# Altium project Front.PrjPcb
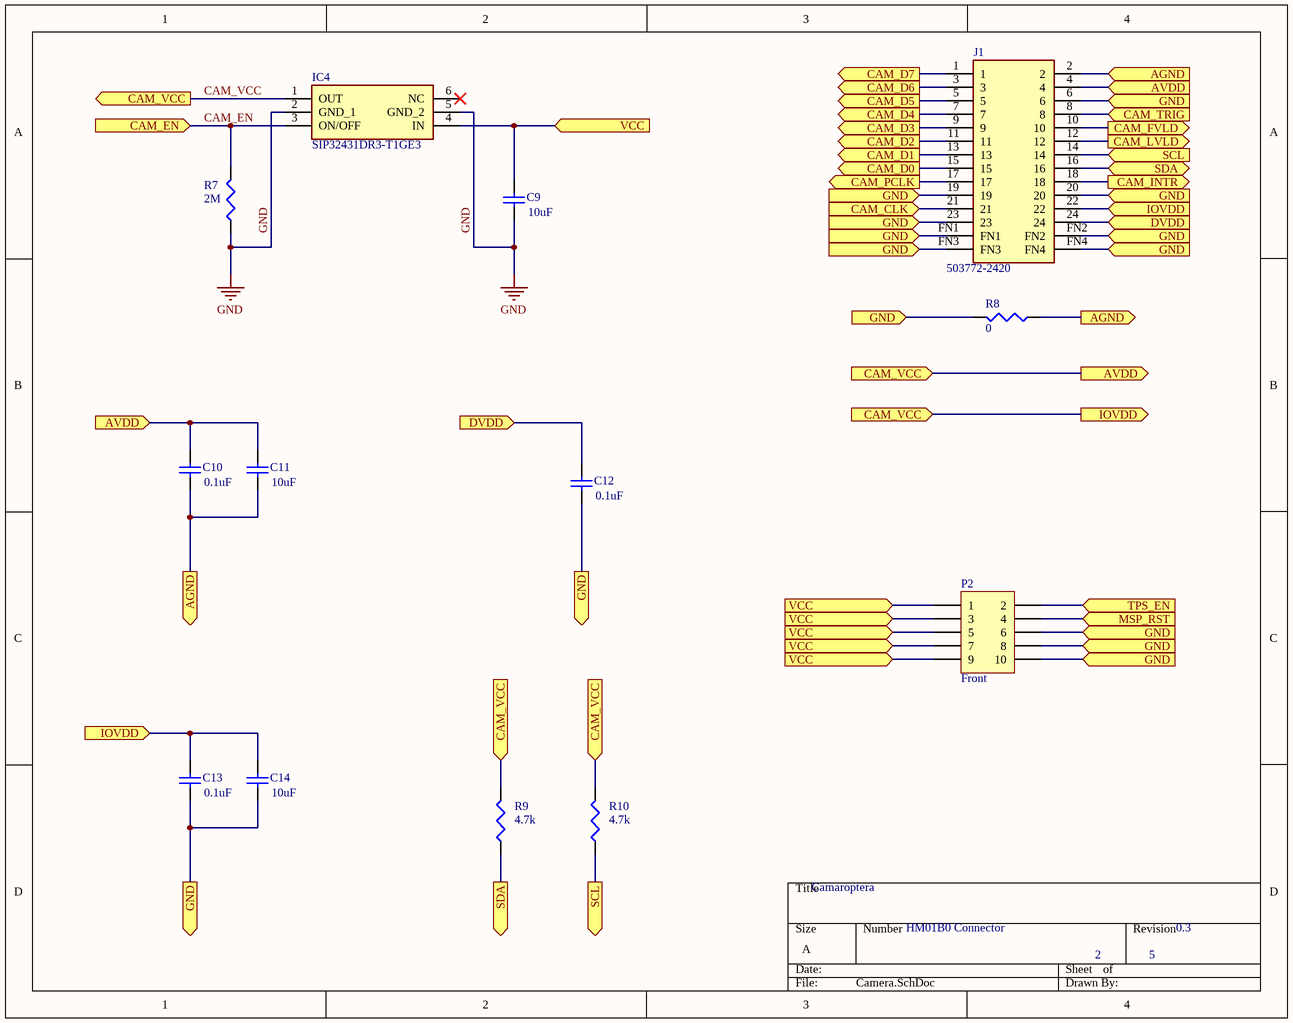
[diagram p0: Camera.SchDoc]
3 sheets, 29 parts. Net scope: flat (ports and power ports of the same name join across sheets).
Board files: Front.PcbDoc, Logos.PcbDoc
Sheets:
  Camera.SchDoc
  Radio.SchDoc
  MCU.SchDoc

## Sheet Camera.SchDoc
size A

### Parts
C9  value 10uF  [1608[0603]]  (hidden comment: Cap)
C10  value 0.1uF  [1608[0603]]  (hidden comment: Cap)
C11  value 10uF  [1608[0603]]  (hidden comment: Cap)
C12  value 0.1uF  [1608[0603]]  (hidden comment: Cap)
C13  value 0.1uF  [1608[0603]]  (hidden comment: Cap)
C14  value 10uF  [1608[0603]]  (hidden comment: Cap)
IC4  SIP32431DR3-T1GE3  [SOT65P210X110-6N]
J1  503772-2420  [5037722410]
P2  Front  [FTE-105-03-X-DH]
R7  value 2M  [J1-0603]  (hidden comment: Res3)
R8  value 0  [J1-0603]  (hidden comment: Res3)
R9  value 4.7k  [J1-0603]  (hidden comment: Res3)
R10  value 4.7k  [J1-0603]  (hidden comment: Res3)

### Ports
AGND (in), AGND (out), AVDD (in), AVDD (out), CAM_CLK (in), CAM_D0 (out), CAM_D1 (out), CAM_D2 (out), CAM_D3 (out), CAM_D4 (out), CAM_D5 (out), CAM_D6 (out), CAM_D7 (out), CAM_EN (in), CAM_FVLD (out), CAM_INTR (out), CAM_LVLD (out), CAM_PCLK (out), CAM_TRIG (in), CAM_VCC (in), CAM_VCC (out), DVDD (in), GND (in), GND (out), IOVDD (in), IOVDD (out), MSP_RST (in), SCL (in), SCL (out), SDA (bidir), SDA (out), TPS_EN (in), VCC (in)

### Nets
GND: C9.1 C12.1 C13.1 C14.1 IC4.2(GND_1) IC4.5(GND_2) J1.6 J1.19 J1.20 J1.23 J1.FN1 J1.FN2 J1.FN3 J1.FN4 P2.6 P2.8 P2.10 R7.1 R8.2 ; port GND
AGND: C10.1 C11.1 J1.2 R8.1 ; port AGND
CAM_CLK: J1.21 ; port CAM_CLK
CAM_D0: J1.15 ; port CAM_D0
CAM_D1: J1.13 ; port CAM_D1
CAM_D2: J1.11 ; port CAM_D2
CAM_D3: J1.9 ; port CAM_D3
CAM_D4: J1.7 ; port CAM_D4
CAM_D5: J1.5 ; port CAM_D5
CAM_D6: J1.3 ; port CAM_D6
CAM_D7: J1.1 ; port CAM_D7
CAM_EN: IC4.3(ON/OFF) R7.2 ; port CAM_EN
CAM_FVLD: J1.10 ; port CAM_FVLD
CAM_INTR: J1.18 ; port CAM_INTR
CAM_LVLD: J1.12 ; port CAM_LVLD
CAM_PCLK: J1.17 ; port CAM_PCLK
CAM_TRIG: J1.8 ; port CAM_TRIG
CAM_VCC: C10.2 C11.2 C13.2 C14.2 IC4.1(OUT) J1.4 J1.22 R9.2 R10.2 ; port CAM_VCC, port AVDD, port IOVDD
DVDD: C12.2 J1.24 ; port DVDD
MSP_RST: P2.4 ; port MSP_RST
SCL: J1.14 R10.1 ; port SCL
SDA: J1.16 R9.1 ; port SDA
TPS_EN: P2.2 ; port TPS_EN
VCC: C9.2 IC4.4(IN) P2.1 P2.3 P2.5 P2.7 P2.9 ; port VCC

Not connected (* = marked no-connect by the designer): IC4 6(NC)*

### Notes on the sheet
- Camaroptera
- HM01B0 Connector
- 2
- 5
- 0.3

### Library data of the parts
C9-C14 = Cap: CAP CER 6.3V X5R/X7R 0603; PackageReference: 0603; Publisher: Altium Limited; PackageDescription: Chip Capacitor, Body 1.6x0.8mm, IPC High Density
IC4 = SIP32431DR3-T1GE3: 10 pA, Ultra Low Leakage and Quiescent Current, / Load Switch with Reverse Blocking; Manufacturer_Name: Vishay; Datasheet Link: https://componentsearchengine.com/Datasheets/1/SIP32431DR3-T1GE3.pdf; Height: 1.1mm; Mouser Part Number: 781-SIP32431DR3-GE3; Mouser Price/Stock: https://www.mouser.com/Search/Refine.aspx?Keyword=781-SIP32431DR3-GE3; Manufacturer_Part_Number: SIP32431DR3-T1GE3; ComponentLink1Description: Datasheet; ComponentLink1URL: https://www.vishay.com/docs/66597/sip32431.pdf; ComponentLink2Description: Package Specification; ComponentLink2URL: https://www.vishay.com/docs/71154/71154.pdf; ComponentLink3Description: Manufacturer URL; ComponentLink3URL: https://www.vishay.com
J1 = 503772-2410: SlimStack Board-to-Board Connector. 0.40mm Pitch, B8 Series, Receptacle, 0.80mm Mated Height, 2.50mm Mated Width, 24 Circuits; Manufacturer_Name: Molex; Datasheet Link: https://componentsearchengine.com/Datasheets/1/503772-2410.pdf; Height: 0.76mm; Mouser Part Number: 538-503772-2410; Mouser Price/Stock: https://www.mouser.com/Search/Refine.aspx?Keyword=538-503772-2410; Manufacturer_Part_Number: 503772-2410; ComponentLink1Description: Package Specification; ComponentLink1URL: https://www.molex.com/pdm_docs/sd/5037722420_sd.pdf; ComponentLink2Description: Manufacturer URL; ComponentLink2URL: https://www.molex.com; ComponentLink3Description: Datasheet; ComponentLink3URL: https://www.molex.com/webdocs/datasheets/pdf/en-us/5037722420_PCB_RECEPTACLES.pdf
P2 = Header 5X2: Front  board connector; LatestRevisionDate: 17-Jul-2002; LatestRevisionNote: Re-released for DXP Platform.; Publisher: Altium Limited; System: Connector
R7-R10 = Res3: RES 1/10W 1% 0603 SMD; PackageReference: 0603; Publisher: Altium Limited; PackageDescription: Chip Resistor, Body 1.6x0.8mm, IPC High Density

## Sheet Radio.SchDoc
size A
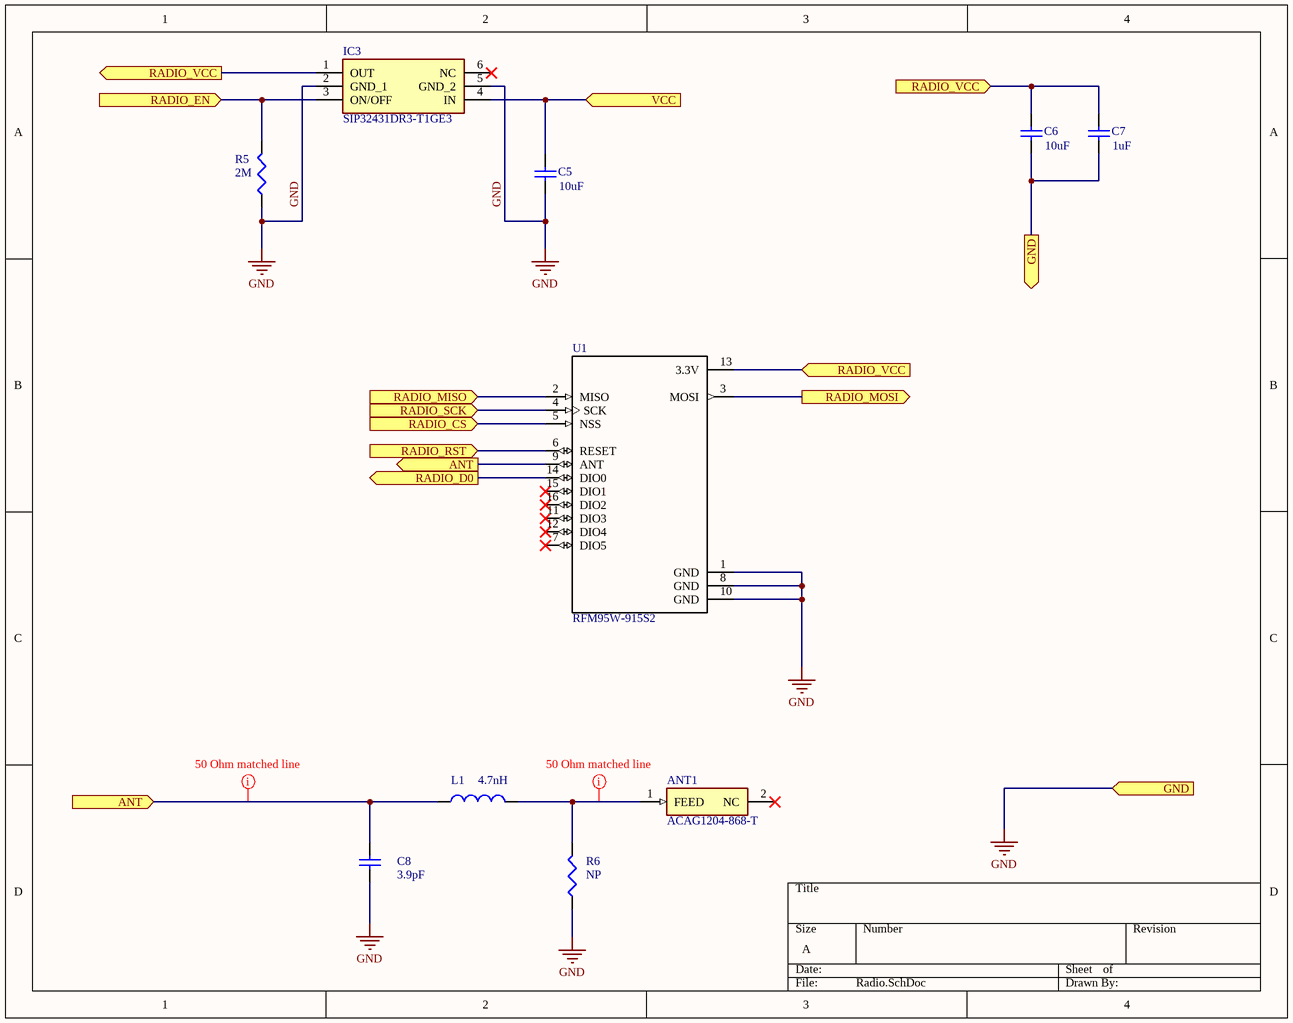
[diagram p1: Radio.SchDoc]

### Parts
ANT1  ACAG1204-868-T  [ANTC12040X170N]
C5  value 10uF  [1608[0603]]  (hidden comment: Cap)
C6  value 10uF  [1608[0603]]  (hidden comment: Cap)
C7  value 1uF  [1608[0603]]  (hidden comment: Cap)
C8  value 3.9pF  [1608[0603]]
IC3  SIP32431DR3-T1GE3  [SOT65P210X110-6N]
L1  value 4.7nH  [1608[0603]]
R5  value 2M  [J1-0603]  (hidden comment: Res3)
R6  value NP  [1608[0603]]
U1  RFM95W-915S2  [*XCVR_RFM69HW-868S2]

### Ports
ANT (in), ANT (out), GND (in), GND (out), RADIO_CS (in), RADIO_D0 (out), RADIO_EN (in), RADIO_MISO (in), RADIO_MOSI (out), RADIO_RST (in), RADIO_SCK (in), RADIO_VCC (in), RADIO_VCC (out), VCC (in)

### Nets
GND: C5.1 C6.1 C7.1 C8.1 IC3.2(GND_1) IC3.5(GND_2) R5.1 R6.1 U1.1(GND) U1.8(GND) U1.10(GND) ; port GND
ANT: C8.2 L1.1 U1.9(ANT) ; port ANT
RADIO_CS: U1.5(NSS) ; port RADIO_CS
RADIO_D0: U1.14(DIO0) ; port RADIO_D0
RADIO_EN: IC3.3(ON/OFF) R5.2 ; port RADIO_EN
RADIO_MISO: U1.2(MISO) ; port RADIO_MISO
RADIO_MOSI: U1.3(MOSI) ; port RADIO_MOSI
RADIO_RST: U1.6(RESET) ; port RADIO_RST
RADIO_SCK: U1.4(SCK) ; port RADIO_SCK
RADIO_VCC: C6.2 C7.2 IC3.1(OUT) U1.13(3.3V) ; port RADIO_VCC
VCC: C5.2 IC3.4(IN) ; port VCC
NetANT1_1: ANT1.1(FEED) L1.2 R6.2

Not connected (* = marked no-connect by the designer): ANT1 2(NC)*; IC3 6(NC)*; U1 7(DIO5)* 11(DIO3)* 12(DIO4)* 15(DIO1)* 16(DIO2)*

### Layout directives
rule Impedance Constraint [Min = 50.00    Max = 50.00    ]: ANT, NetANT1_1

### Library data of the parts
ANT1 = ACAG1204-868-T: Antenna; Manufacturer_Name: ABRACON; Datasheet Link: https://componentsearchengine.com/Datasheets/1/ACAG1204-868-T.pdf; Height: 1.7mm; Mouser Part Number: 815-G1204-868-T; Mouser Price/Stock: https://www.mouser.com/Search/Refine.aspx?Keyword=815-G1204-868-T; Manufacturer_Part_Number: ACAG1204-868-T
C5-C7 = Cap: CAP CER 6.3V X5R/X7R 0603; PackageReference: 0603; Publisher: Altium Limited; PackageDescription: Chip Capacitor, Body 1.6x0.8mm, IPC High Density
C8 = Cap: Capacitor; Published: 8-Jun-2000; LatestRevisionDate: 17-Jul-2002; LatestRevisionNote: Re-released for DXP Platform.; PackageReference: RAD-0.3; Publisher: Altium Limited; PackageDescription: Radial Cap, Thru-Hole; 2 Leads; 0.3 in Pin Spacing
IC3 = SIP32431DR3-T1GE3: as IC4 on sheet Camera; Datasheet Link: https://componentsearchengine.com/Datasheets/1/SIP32431DR3-T1GE3.pdf; Height: 1.1mm; Mouser Part Number: 781-SIP32431DR3-GE3; Mouser Price/Stock: https://www.mouser.com/Search/Refine.aspx?Keyword=781-SIP32431DR3-GE3; Manufacturer_Part_Number: SIP32431DR3-T1GE3; ComponentLink1Description: Datasheet; ComponentLink1URL: https://www.vishay.com/docs/66597/sip32431.pdf; ComponentLink2Description: Package Specification; ComponentLink2URL: https://www.vishay.com/docs/71154/71154.pdf; ComponentLink3Description: Manufacturer URL; ComponentLink3URL: https://www.vishay.com
L1 = Inductor: Code_IEC: 1005; Published: 8-Jun-2000; LatestRevisionDate: 29-May-2009; LatestRevisionNote: IPC-7351 Footprint Added.; PackageReference: 0402-A; Publisher: Altium Limited; PackageDescription: Chip Inductor; Code_JEITA: 0402
R5 = Res3: RES 1/10W 1% 0603 SMD; PackageReference: 0603; Publisher: Altium Limited; PackageDescription: Chip Resistor, Body 1.6x0.8mm, IPC High Density
R6 = Res3: Resistor; Published: 8-Jun-2000; LatestRevisionDate: 29-May-2009; LatestRevisionNote: IPC-7351 Footprint Added.; PackageReference: J1-0603; Publisher: Altium Limited; PackageDescription: Chip Resistor
U1 = RFM95W-915S2: RFM95W LoRA Transceiver Module 915MHz; MF: RF Solutions; Availability: Unavailable; SnapEDA_Link: https://www.snapeda.com/parts/RFM95W-915S2/RF%20Solutions/view-part/?ref=snap; Price: None; Package: SMD-16 RF Solutions; MP: RFM95W-915S2; Value: *

## Sheet MCU.SchDoc
size A
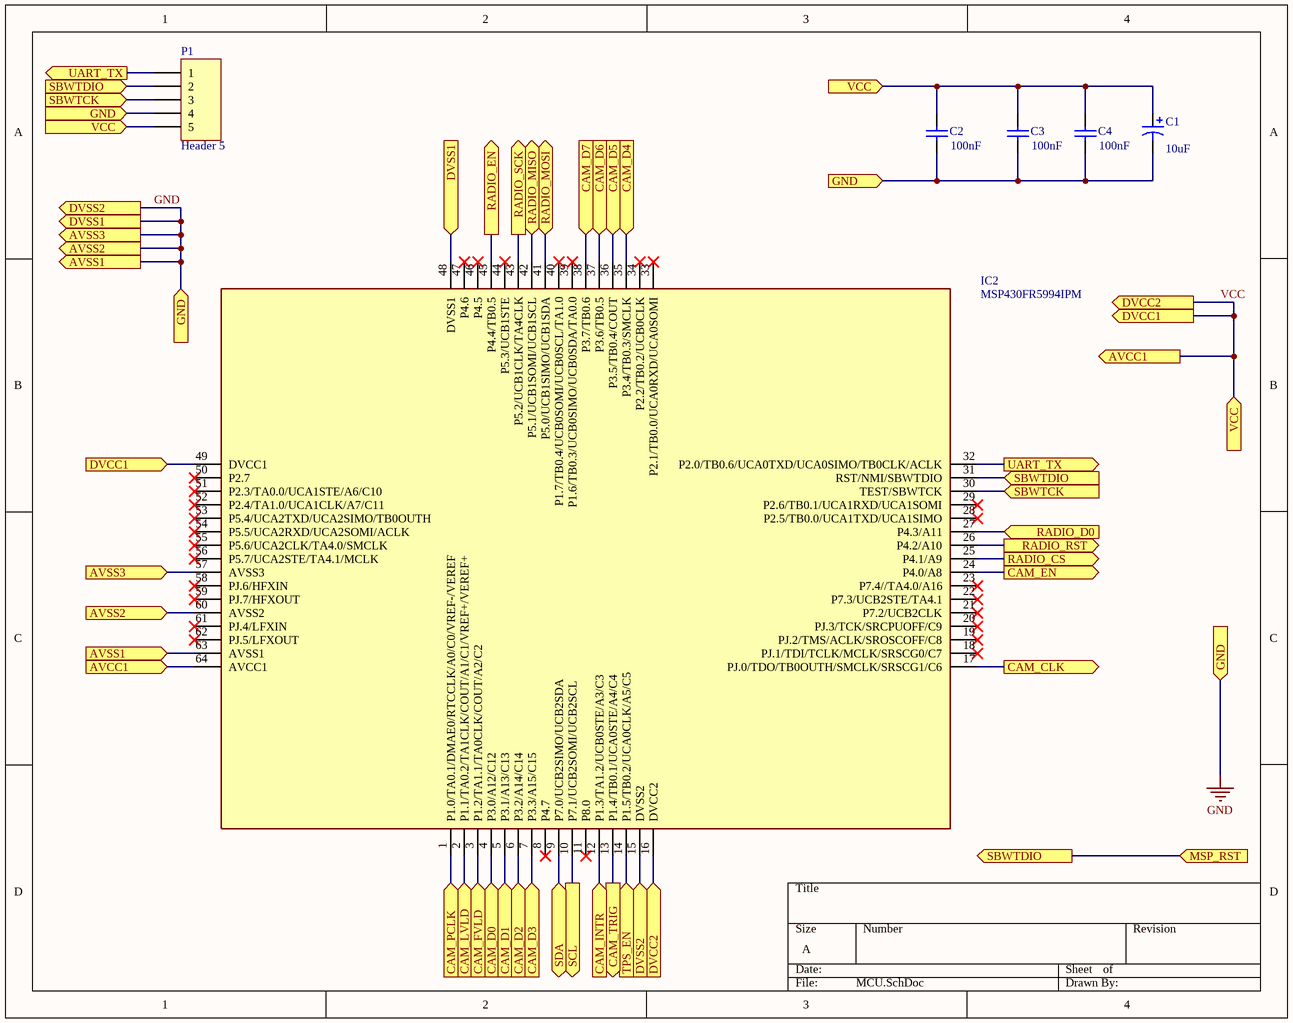
[diagram p2: MCU.SchDoc]

### Parts
C1  value 10uF  [C1210]
C2  value 100nF  [1608[0603]]  (hidden comment: Cap)
C3  value 100nF  [1608[0603]]  (hidden comment: Cap)
C4  value 100nF  [1608[0603]]  (hidden comment: Cap)
IC2  MSP430FR5994IPM  [QFP50P1200X1200X160-64N]
P1  Header 5  [MHDR1X5]

### Ports
AVCC1 (in), AVCC1 (out), AVSS1 (in), AVSS1 (out), AVSS2 (in), AVSS2 (out), AVSS3 (in), AVSS3 (out), CAM_CLK (out), CAM_D0 (in), CAM_D1 (in), CAM_D2 (in), CAM_D3 (in), CAM_D4 (in), CAM_D5 (in), CAM_D6 (in), CAM_D7 (in), CAM_EN (out), CAM_FVLD (in), CAM_INTR (in), CAM_LVLD (in), CAM_PCLK (in), CAM_TRIG (out), DVCC1 (in), DVCC1 (out), DVCC2 (in), DVCC2 (out), DVSS1 (in), DVSS1 (out), DVSS2 (in), DVSS2 (out), GND (in), MSP_RST (in), RADIO_CS (out), RADIO_D0 (in), RADIO_EN (out), RADIO_MISO (bidir), RADIO_MOSI (bidir), RADIO_RST (out), RADIO_SCK (out), SBWTCK (in), SBWTDIO (in), SBWTDIO (out), SCL (out), SDA (bidir), TPS_EN (in), UART_TX (out), VCC (in)

### Nets
GND: C1.2 C2.1 C3.1 C4.1 IC2.15(DVSS2) IC2.48(DVSS1) IC2.57(AVSS3) IC2.60(AVSS2) IC2.63(AVSS1) P1.4 ; port DVSS2, port AVSS1, port DVSS1, port AVSS2, port AVSS3, port GND
CAM_CLK: IC2.17(PJ.0/TDO/TB0OUTH/SMCLK/SRSCG1/C6) ; port CAM_CLK
CAM_D0: IC2.4(P3.0/A12/C12) ; port CAM_D0
CAM_D1: IC2.5(P3.1/A13/C13) ; port CAM_D1
CAM_D2: IC2.6(P3.2/A14/C14) ; port CAM_D2
CAM_D3: IC2.7(P3.3/A15/C15) ; port CAM_D3
CAM_D4: IC2.35(P3.4/TB0.3/SMCLK) ; port CAM_D4
CAM_D5: IC2.36(P3.5/TB0.4/COUT) ; port CAM_D5
CAM_D6: IC2.37(P3.6/TB0.5) ; port CAM_D6
CAM_D7: IC2.38(P3.7/TB0.6) ; port CAM_D7
CAM_EN: IC2.24(P4.0/A8) ; port CAM_EN
CAM_FVLD: IC2.3(P1.2/TA1.1/TA0CLK/COUT/A2/C2) ; port CAM_FVLD
CAM_INTR: IC2.12(P1.3/TA1.2/UCB0STE/A3/C3) ; port CAM_INTR
CAM_LVLD: IC2.2(P1.1/TA0.2/TA1CLK/COUT/A1/C1/VREF+/VEREF+) ; port CAM_LVLD
CAM_PCLK: IC2.1(P1.0/TA0.1/DMAE0/RTCCLK/A0/C0/VREF-/VEREF) ; port CAM_PCLK
CAM_TRIG: IC2.13(P1.4/TB0.1/UCA0STE/A4/C4) ; port CAM_TRIG
MSP_RST: IC2.31(RST/NMI/SBWTDIO) P1.2 ; port SBWTDIO, port MSP_RST
RADIO_CS: IC2.25(P4.1/A9) ; port RADIO_CS
RADIO_D0: IC2.27(P4.3/A11) ; port RADIO_D0
RADIO_EN: IC2.45(P4.4/TB0.5) ; port RADIO_EN
RADIO_MISO: IC2.42(P5.1/UCB1SOMI/UCB1SCL) ; port RADIO_MISO
RADIO_MOSI: IC2.41(P5.0/UCB1SIMO/UCB1SDA) ; port RADIO_MOSI
RADIO_RST: IC2.26(P4.2/A10) ; port RADIO_RST
RADIO_SCK: IC2.43(P5.2/UCB1CLK/TA4CLK) ; port RADIO_SCK
SBWTCK: IC2.30(TEST/SBWTCK) P1.3 ; port SBWTCK
SCL: IC2.10(P7.1/UCB2SOMI/UCB2SCL) ; port SCL
SDA: IC2.9(P7.0/UCB2SIMO/UCB2SDA) ; port SDA
TPS_EN: IC2.14(P1.5/TB0.2/UCA0CLK/A5/C5) ; port TPS_EN
UART_TX: IC2.32(P2.0/TB0.6/UCA0TXD/UCA0SIMO/TB0CLK/ACLK) P1.1 ; port UART_TX
VCC: C1.1 C2.2 C3.2 C4.2 IC2.16(DVCC2) IC2.49(DVCC1) IC2.64(AVCC1) P1.5 ; port DVCC2, port AVCC1, port DVCC1, port VCC

Not connected (* = marked no-connect by the designer): IC2 8(P4.7)* 11(P8.0)* 18(PJ.1/TDI/TCLK/MCLK/SRSCG0/C7)* 19(PJ.2/TMS/ACLK/SROSCOFF/C8)* 20(PJ.3/TCK/SRCPUOFF/C9)* 21(P7.2/UCB2CLK)* 22(P7.3/UCB2STE/TA4.1)* 23(P7.4//TA4.0/A16)* 28(P2.5/TB0.0/UCA1TXD/UCA1SIMO)* 29(P2.6/TB0.1/UCA1RXD/UCA1SOMI)* 33(P2.1/TB0.0/UCA0RXD/UCA0SOMI)* 34(P2.2/TB0.2/UCB0CLK)* 39(P1.6/TB0.3/UCB0SIMO/UCB0SDA/TA0.0)* 40(P1.7/TB0.4/UCB0SOMI/UCB0SCL/TA1.0)* 44(P5.3/UCB1STE)* 46(P4.5)* 47(P4.6)* 50(P2.7)* 51(P2.3/TA0.0/UCA1STE/A6/C10)* 52(P2.4/TA1.0/UCA1CLK/A7/C11)* 53(P5.4/UCA2TXD/UCA2SIMO/TB0OUTH)* 54(P5.5/UCA2RXD/UCA2SOMI/ACLK)* 55(P5.6/UCA2CLK/TA4.0/SMCLK)* 56(P5.7/UCA2STE/TA4.1/MCLK)* 58(PJ.6/HFXIN)* 59(PJ.7/HFXOUT)* 61(PJ.4/LFXIN)* 62(PJ.5/LFXOUT)*

### Library data of the parts
C1 = Cap Pol3: Polarized Capacitor (Surface Mount); Published: 8-Jun-2000; LatestRevisionDate: 29-May-2009; LatestRevisionNote: IPC-7351 Footprint Added.; PackageReference: C0805; Publisher: Altium Limited; PackageDescription: Chip Capacitor
C2-C4 = Cap: CAP CER 6.3V X5R/X7R 0603; PackageReference: 0603; Publisher: Altium Limited; PackageDescription: Chip Capacitor, Body 1.6x0.8mm, IPC High Density
IC2 = MSP430FR5994IPM: Integrated Circuit; Manufacturer_Name: Texas Instruments; Datasheet Link: http://www.ti.com/lit/gpn/msp430fr5994; Height: 1.6mm; Mouser Part Number: 595-MSP430FR5994IPM; Mouser Price/Stock: https://www.mouser.com/Search/Refine.aspx?Keyword=595-MSP430FR5994IPM; Manufacturer_Part_Number: MSP430FR5994IPM
P1 = Header 5: Header, 5-Pin; LatestRevisionDate: 17-Jul-2002; LatestRevisionNote: Re-released for DXP Platform.; Publisher: Altium Limited

## Nets that join several sheets
GND: Camera (19 pins), Radio (11 pins), MCU (10 pins)
CAM_CLK: Camera (J1.21), MCU (IC2.17)
CAM_D0: Camera (J1.15), MCU (IC2.4)
CAM_D1: Camera (J1.13), MCU (IC2.5)
CAM_D2: Camera (J1.11), MCU (IC2.6)
CAM_D3: Camera (J1.9), MCU (IC2.7)
CAM_D4: Camera (J1.7), MCU (IC2.35)
CAM_D5: Camera (J1.5), MCU (IC2.36)
CAM_D6: Camera (J1.3), MCU (IC2.37)
CAM_D7: Camera (J1.1), MCU (IC2.38)
CAM_EN: Camera (IC4.3 R7.2), MCU (IC2.24)
CAM_FVLD: Camera (J1.10), MCU (IC2.3)
CAM_INTR: Camera (J1.18), MCU (IC2.12)
CAM_LVLD: Camera (J1.12), MCU (IC2.2)
CAM_PCLK: Camera (J1.17), MCU (IC2.1)
CAM_TRIG: Camera (J1.8), MCU (IC2.13)
MSP_RST: Camera (P2.4), MCU (IC2.31 P1.2)
RADIO_CS: Radio (U1.5), MCU (IC2.25)
RADIO_D0: Radio (U1.14), MCU (IC2.27)
RADIO_EN: Radio (IC3.3 R5.2), MCU (IC2.45)
RADIO_MISO: Radio (U1.2), MCU (IC2.42)
RADIO_MOSI: Radio (U1.3), MCU (IC2.41)
RADIO_RST: Radio (U1.6), MCU (IC2.26)
RADIO_SCK: Radio (U1.4), MCU (IC2.43)
SCL: Camera (J1.14 R10.1), MCU (IC2.10)
SDA: Camera (J1.16 R9.1), MCU (IC2.9)
TPS_EN: Camera (P2.2), MCU (IC2.14)
VCC: Camera (7 pins), Radio (C5.2 IC3.4), MCU (8 pins)